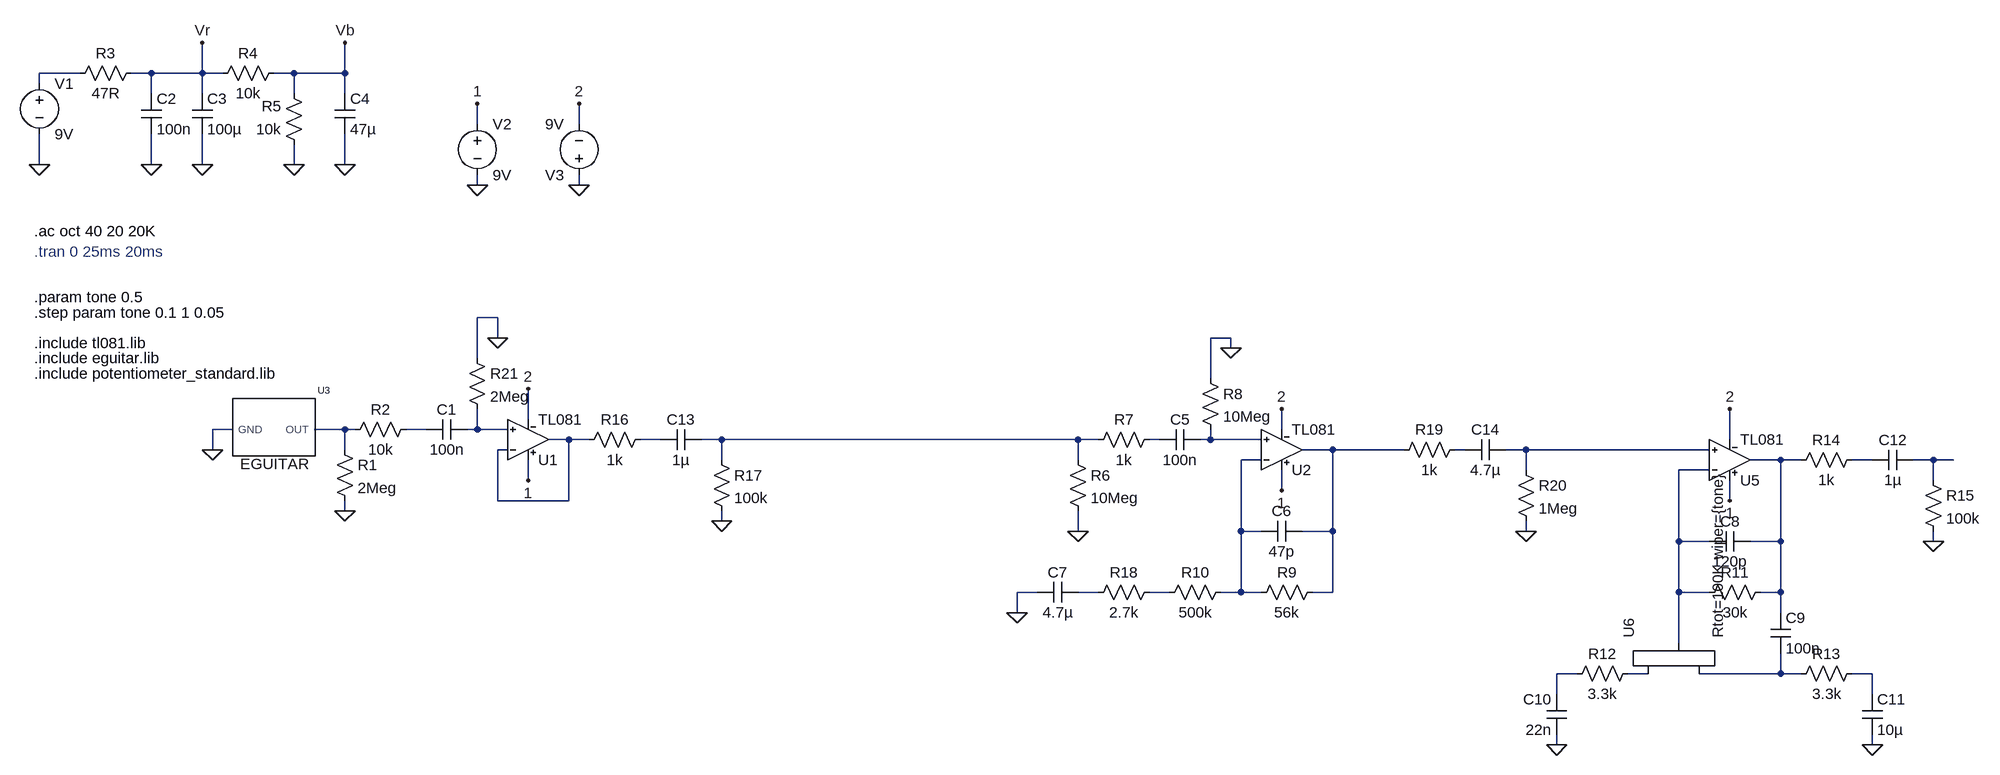
[diagram p0: schematic Booster2.asc]
Booster2.asc, the LTspice schematic file:
Version 4
SHEET 1 2828 852
WIRE -160 -224 -224 -224
WIRE -48 -224 -80 -224
WIRE 32 -224 32 -272
WIRE 32 -224 -48 -224
WIRE 64 -224 32 -224
WIRE 176 -224 144 -224
WIRE 256 -224 256 -272
WIRE 256 -224 176 -224
WIRE -224 -208 -224 -224
WIRE -48 -192 -48 -224
WIRE 32 -192 32 -224
WIRE 176 -192 176 -224
WIRE 256 -192 256 -224
WIRE 464 -144 464 -176
WIRE 624 -144 624 -176
WIRE -224 -80 -224 -128
WIRE -48 -80 -48 -128
WIRE 32 -80 32 -128
WIRE 176 -80 176 -112
WIRE 256 -80 256 -128
WIRE 464 -48 464 -64
WIRE 624 -48 624 -64
WIRE 496 160 464 160
WIRE 496 192 496 160
WIRE 1648 192 1616 192
WIRE 1648 208 1648 192
WIRE 464 224 464 160
WIRE 1616 256 1616 192
WIRE 544 320 544 272
WIRE 80 336 48 336
WIRE 256 336 208 336
WIRE 272 336 256 336
WIRE 384 336 352 336
WIRE 464 336 464 304
WIRE 464 336 448 336
WIRE 512 336 464 336
WIRE 1728 336 1728 304
WIRE 608 352 576 352
WIRE 640 352 608 352
WIRE 752 352 720 352
WIRE 848 352 816 352
WIRE 1408 352 848 352
WIRE 1440 352 1408 352
WIRE 1536 352 1520 352
WIRE 1616 352 1616 336
WIRE 1616 352 1600 352
WIRE 1696 352 1616 352
WIRE 2432 352 2432 304
WIRE 48 368 48 336
WIRE 256 368 256 336
WIRE 512 368 496 368
WIRE 1808 368 1760 368
WIRE 1920 368 1808 368
WIRE 2016 368 2000 368
WIRE 2112 368 2080 368
WIRE 2400 368 2112 368
WIRE 848 384 848 352
WIRE 1408 384 1408 352
WIRE 1696 384 1664 384
WIRE 2512 384 2464 384
WIRE 2544 384 2512 384
WIRE 2656 384 2624 384
WIRE 2752 384 2720 384
WIRE 2784 384 2752 384
WIRE 2112 400 2112 368
WIRE 2400 400 2352 400
WIRE 544 416 544 384
WIRE 2752 416 2752 384
WIRE 1728 432 1728 400
WIRE 496 448 496 368
WIRE 608 448 608 352
WIRE 608 448 496 448
WIRE 2432 448 2432 416
WIRE 256 464 256 448
WIRE 848 480 848 464
WIRE 1408 496 1408 464
WIRE 1664 496 1664 384
WIRE 1696 496 1664 496
WIRE 1808 496 1808 368
WIRE 1808 496 1760 496
WIRE 2112 496 2112 480
WIRE 2352 512 2352 400
WIRE 2400 512 2352 512
WIRE 2512 512 2512 384
WIRE 2512 512 2464 512
WIRE 2752 512 2752 496
WIRE 1344 592 1312 592
WIRE 1440 592 1408 592
WIRE 1552 592 1520 592
WIRE 1664 592 1664 496
WIRE 1664 592 1632 592
WIRE 1696 592 1664 592
WIRE 1808 592 1808 496
WIRE 1808 592 1776 592
WIRE 2352 592 2352 512
WIRE 2400 592 2352 592
WIRE 2512 592 2512 512
WIRE 2512 592 2480 592
WIRE 1312 624 1312 592
WIRE 2512 624 2512 592
WIRE 2352 672 2352 592
WIRE 2192 720 2160 720
WIRE 2304 720 2272 720
WIRE 2512 720 2512 688
WIRE 2512 720 2384 720
WIRE 2544 720 2512 720
WIRE 2656 720 2624 720
WIRE 2160 752 2160 720
WIRE 2656 752 2656 720
WIRE 2160 832 2160 816
WIRE 2656 832 2656 816
FLAG 176 -80 0
FLAG 256 -80 0
FLAG 32 -80 0
FLAG -48 -80 0
FLAG 32 -272 Vr
FLAG 256 -272 Vb
FLAG 48 368 0
FLAG -224 -80 0
FLAG 256 464 0
FLAG 2160 832 0
FLAG 2656 832 0
FLAG 2752 512 0
FLAG 848 480 0
FLAG 464 -48 0
FLAG 464 -176 1
FLAG 544 416 1
FLAG 544 272 2
FLAG 624 -48 0
FLAG 624 -176 2
FLAG 1728 432 1
FLAG 1728 304 2
FLAG 1408 496 0
FLAG 1648 208 0
FLAG 1312 624 0
FLAG 2432 304 2
FLAG 2432 448 1
FLAG 2112 496 0
FLAG 496 192 0
SYMBOL res -64 -240 R90
WINDOW 0 0 56 VBottom 2
WINDOW 3 32 56 VTop 2
SYMATTR InstName R3
SYMATTR Value 47R
SYMBOL cap -64 -192 R0
SYMATTR InstName C2
SYMATTR Value 100n
SYMBOL cap 16 -192 R0
SYMATTR InstName C3
SYMATTR Value 100µ
SYMBOL res 160 -240 R90
WINDOW 0 0 56 VBottom 2
WINDOW 3 32 56 VTop 2
SYMATTR InstName R4
SYMATTR Value 10k
SYMBOL res 192 -96 R180
WINDOW 0 36 76 Left 2
WINDOW 3 36 40 Left 2
SYMATTR InstName R5
SYMATTR Value 10k
SYMBOL cap 240 -192 R0
SYMATTR InstName C4
SYMATTR Value 47µ
SYMBOL eguitar 176 352 R0
SYMATTR InstName U3
SYMBOL voltage -224 -224 R0
WINDOW 123 0 0 Left 0
WINDOW 39 0 0 Left 0
SYMATTR InstName V1
SYMATTR Value 9V
SYMBOL res 240 352 R0
SYMATTR InstName R1
SYMATTR Value 2Meg
SYMBOL cap 448 320 R90
WINDOW 0 0 32 VBottom 2
WINDOW 3 32 32 VTop 2
SYMATTR InstName C1
SYMATTR Value 100n
SYMBOL TL081 544 416 M180
SYMATTR InstName U1
SYMATTR Value TL081
SYMBOL TL081 1728 432 M180
SYMATTR InstName U2
SYMATTR Value TL081
SYMBOL TL081 2432 448 M180
SYMATTR InstName U5
SYMATTR Value TL081
SYMBOL cap 2464 496 R90
WINDOW 0 0 32 VBottom 2
WINDOW 3 32 32 VTop 2
SYMATTR InstName C8
SYMATTR Value 120p
SYMBOL res 2496 576 R90
WINDOW 0 0 56 VBottom 2
WINDOW 3 32 56 VTop 2
SYMATTR InstName R11
SYMATTR Value 30k
SYMBOL cap 2496 624 R0
SYMATTR InstName C9
SYMATTR Value 100n
SYMBOL potentiometer_standard 2288 736 R270
SYMATTR InstName U6
SYMATTR Value Rtot=100K wiper={tone}
SYMATTR SpiceLine ""
SYMBOL res 2288 704 R90
WINDOW 0 0 56 VBottom 2
WINDOW 3 32 56 VTop 2
SYMATTR InstName R12
SYMATTR Value 3.3k
SYMBOL cap 2176 816 R180
WINDOW 0 24 56 Left 2
WINDOW 3 24 8 Left 2
SYMATTR InstName C10
SYMATTR Value 22n
SYMBOL res 2640 704 R90
WINDOW 0 0 56 VBottom 2
WINDOW 3 32 56 VTop 2
SYMATTR InstName R13
SYMATTR Value 3.3k
SYMBOL cap 2640 752 R0
SYMATTR InstName C11
SYMATTR Value 10µ
SYMBOL res 2640 368 R90
WINDOW 0 0 56 VBottom 2
WINDOW 3 32 56 VTop 2
SYMATTR InstName R14
SYMATTR Value 1k
SYMBOL cap 2720 368 R90
WINDOW 0 0 32 VBottom 2
WINDOW 3 32 32 VTop 2
SYMATTR InstName C12
SYMATTR Value 1µ
SYMBOL res 2736 400 R0
SYMATTR InstName R15
SYMATTR Value 100k
SYMBOL cap 816 336 R90
WINDOW 0 0 32 VBottom 2
WINDOW 3 32 32 VTop 2
SYMATTR InstName C13
SYMATTR Value 1µ
SYMBOL res 832 368 R0
SYMATTR InstName R17
SYMATTR Value 100k
SYMBOL res 368 320 R90
WINDOW 0 0 56 VBottom 2
WINDOW 3 32 56 VTop 2
SYMATTR InstName R2
SYMATTR Value 10k
SYMBOL res 736 336 R90
WINDOW 0 0 56 VBottom 2
WINDOW 3 32 56 VTop 2
SYMATTR InstName R16
SYMATTR Value 1k
SYMBOL voltage 464 -160 R0
WINDOW 123 0 0 Left 0
WINDOW 39 0 0 Left 0
SYMATTR InstName V2
SYMATTR Value 9V
SYMBOL voltage 624 -48 R180
WINDOW 123 0 0 Left 0
WINDOW 39 0 0 Left 0
SYMATTR InstName V3
SYMATTR Value 9V
SYMBOL res 1392 368 R0
SYMATTR InstName R6
SYMATTR Value 10Meg
SYMBOL res 1536 336 R90
WINDOW 0 0 56 VBottom 2
WINDOW 3 32 56 VTop 2
SYMATTR InstName R7
SYMATTR Value 1k
SYMBOL cap 1600 336 R90
WINDOW 0 0 32 VBottom 2
WINDOW 3 32 32 VTop 2
SYMATTR InstName C5
SYMATTR Value 100n
SYMBOL res 1600 240 R0
SYMATTR InstName R8
SYMATTR Value 10Meg
SYMBOL cap 1760 480 R90
WINDOW 0 0 32 VBottom 2
WINDOW 3 32 32 VTop 2
SYMATTR InstName C6
SYMATTR Value 47p
SYMBOL res 1792 576 R90
WINDOW 0 0 56 VBottom 2
WINDOW 3 32 56 VTop 2
SYMATTR InstName R9
SYMATTR Value 56k
SYMBOL res 1648 576 R90
WINDOW 0 0 56 VBottom 2
WINDOW 3 32 56 VTop 2
SYMATTR InstName R10
SYMATTR Value 500k
SYMBOL res 1536 576 R90
WINDOW 0 0 56 VBottom 2
WINDOW 3 32 56 VTop 2
SYMATTR InstName R18
SYMATTR Value 2.7k
SYMBOL cap 1408 576 R90
WINDOW 0 0 32 VBottom 2
WINDOW 3 32 32 VTop 2
SYMATTR InstName C7
SYMATTR Value 4.7µ
SYMBOL res 2016 352 R90
WINDOW 0 0 56 VBottom 2
WINDOW 3 32 56 VTop 2
SYMATTR InstName R19
SYMATTR Value 1k
SYMBOL cap 2080 352 R90
WINDOW 0 0 32 VBottom 2
WINDOW 3 32 32 VTop 2
SYMATTR InstName C14
SYMATTR Value 4.7µ
SYMBOL res 2096 384 R0
SYMATTR InstName R20
SYMATTR Value 1Meg
SYMBOL res 448 208 R0
SYMATTR InstName R21
SYMATTR Value 2Meg
TEXT -232 24 Left 2 !.ac oct 40 20 20K
TEXT -232 56 Left 2 ;.tran 0 25ms 20ms
TEXT -232 128 Left 2 !.param tone 0.5
TEXT -232 152 Left 2 !.step param tone 0.1 1 0.05
TEXT -232 224 Left 2 !.include eguitar.lib
TEXT -232 248 Left 2 !.include potentiometer_standard.lib
TEXT -232 200 Left 2 !.include tl081.lib

The netlist it stands for:
* Booster2.asc
R3 Vr N001 47R
C2 Vr 0 100n
C3 Vr 0 100µ
R4 Vb Vr 10k
R5 0 Vb 10k
C4 Vb 0 47µ
XU3 N002 0 EGUITAR  ; pins OUT GND
V1 N001 0 9V
R1 N002 0 2Meg
C1 N004 N003 100n
XU1 N004 N005 1 2 N005 TL081 TL081  ; pins In+ In- V+ V- OUT
XU2 N009 N013 1 2 N010 TL081 TL081  ; pins In+ In- V+ V- OUT
XU5 N012 N017 1 2 N014 TL081 TL081  ; pins In+ In- V+ V- OUT
C8 N014 N017 120p
R11 N014 N017 30k
C9 N014 N022 100n
XU6 N021 N022 N017 Rtot=100K wiper={tone}
R12 N021 N020 3.3k
C10 0 N020 22n
R13 N023 N022 3.3k
C11 N023 0 10µ
R14 N015 N014 1k
C12 N016 N015 1µ
R15 N016 0 100k
C13 N007 N006 1µ
R17 N007 0 100k
R2 N003 N002 10k
R16 N006 N005 1k
V2 1 0 9V
V3 0 2 9V
R6 N007 0 10Meg
R7 N008 N007 1k
C5 N009 N008 100n
R8 0 N009 10Meg
C6 N010 N013 47p
R9 N010 N013 56k
R10 N013 N019 500k
R18 N019 N018 2.7k
C7 N018 0 4.7µ
R19 N011 N010 1k
C14 N012 N011 4.7µ
R20 N012 0 1Meg
R21 0 N004 2Meg
.ac oct 40 20 20K
* .tran 0 25ms 20ms
.param tone 0.5
.step param tone 0.1 1 0.05
.include eguitar.lib
.include potentiometer_standard.lib
.include tl081.lib
.lib eguitar.lib
.lib TL081.lib
.backanno
.end